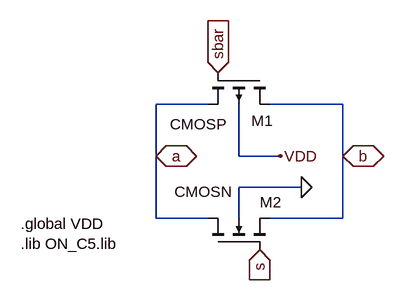
[diagram p0: schematic tgate.asc]
tgate.asc, the LTspice schematic file:
Version 4
SHEET 1 880 680
WIRE 192 144 112 144
WIRE 400 144 288 144
WIRE 112 224 112 144
WIRE 240 224 240 144
WIRE 304 224 240 224
WIRE 400 224 400 144
WIRE 336 272 240 272
WIRE 112 320 112 224
WIRE 192 320 112 320
WIRE 240 320 240 272
WIRE 400 320 400 224
WIRE 400 320 288 320
FLAG 304 224 VDD
FLAG 336 272 0
FLAG 400 224 b
IOPIN 400 224 BiDir
FLAG 112 224 a
IOPIN 112 224 BiDir
FLAG 208 96 sbar
IOPIN 208 96 In
FLAG 272 368 s
IOPIN 272 368 In
SYMBOL pmos4 288 96 R90
WINDOW 0 74 -5 VRight 2
WINDOW 3 79 66 VRight 2
SYMATTR InstName M1
SYMATTR Value CMOSP
SYMATTR Value2 l=0.6u w=1.8u
SYMBOL nmos4 192 368 R270
WINDOW 0 73 80 VRight 2
WINDOW 3 89 -51 VRight 2
SYMATTR InstName M2
SYMATTR Value CMOSN
SYMATTR Value2 l=0.6u w=0.9u
TEXT -96 328 Left 2 !.global VDD\n.lib ON_C5.lib

The netlist it stands for:
* tgate.asc
M1 b sbar a VDD CMOSP l=0.6u w=1.8u
M2 a s b 0 CMOSN l=0.6u w=0.9u
.model NMOS NMOS
.model PMOS PMOS
.lib standard.mos
.global VDD
.lib ON_C5.lib
.backanno
.end